# Altium schematic sheet Microcontroller's_Prephirals_Sheet.SchDoc
size A; SheetNumber: 3; SheetTotal: 7
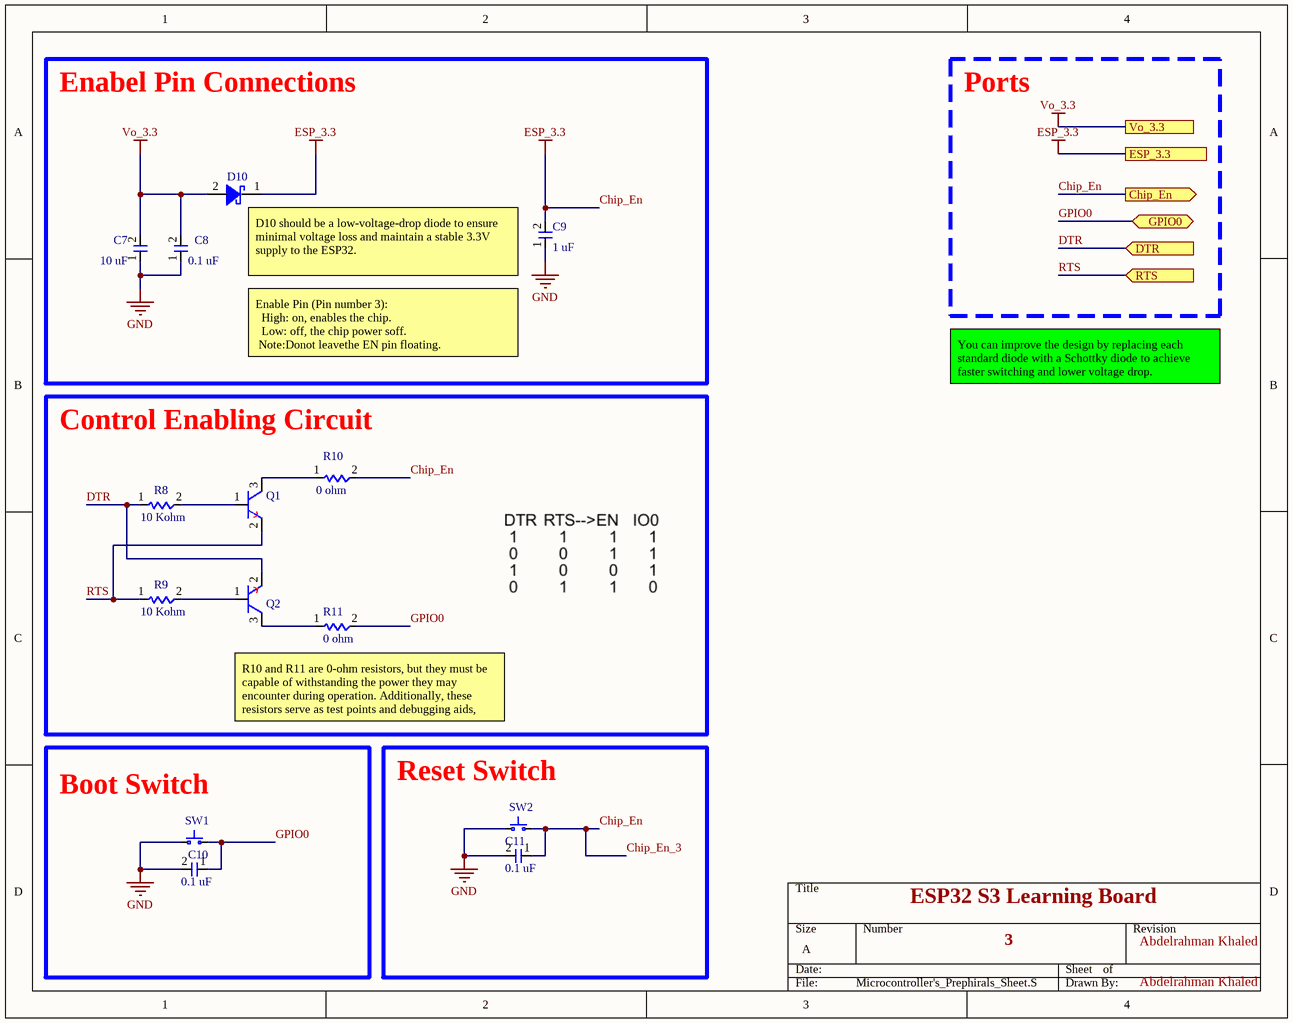
[diagram p0: Microcontroller's_Prephirals_Sheet.SchDoc]

## Parts
C7  10 uF  [Capacitor]
C8  0.1 uF  [Capacitor]
C9  1 uF  [Capacitor]
C10  0.1 uF  [Capacitor]
C11  0.1 uF  [Capacitor]
D10  0.2V Drop Volt  [Schoktty Diode]  (value not drawn)
Q1  NPN Transistor  [NPN Transistor]  (value not drawn)
Q2  NPN Transistor  [NPN Transistor]  (value not drawn)
R8  10 Kohm  [Resistor]
R9  10 Kohm  [Resistor]
R10  0 ohm  [Resistor]
R11  0 ohm  [Resistor]
SW1  Push Button  [Push Button]  (value not drawn)
SW2  Push Button  [Push Button]  (value not drawn)

## Blocks framed on the sheet
Enabel Pin Connections: C7-C9 D10
Control Enabling Circuit: Q1 Q2 R8-R11
Boot Switch: C10 SW1
Reset Switch: C11 SW2

## Ports
Chip_En (out, see Block Diagram[3B], Microcontroller_ESP32_S3[4C]), DTR (in, see Block Diagram[3B], USB_UART_Converter[3B]), ESP_3.3 (see Block Diagram[3B], Microcontroller_ESP32_S3[4C]), GPIO0 (bidir, see Block Diagram[3B], Microcontroller_ESP32_S3[4C]), RTS (in, see Block Diagram[3B], USB_UART_Converter[3B]), Vo_3.3 (see Block Diagram[3B], LDO_Sheet[4B], RGB_Logical_Shifter_Sheet[4A], USB_UART_Converter[4A])

## Nets
Chip_En: C9.2(Pin_2) C11.1(Pin_1) D10.1 R10.2(pin_2) SW2.2 ; port Chip_En, port ESP_3.3  [also labelled Chip_En_3, ESP_3.3]
GND: C7.1(Pin_1) C8.1(Pin_1) C9.1(Pin_1) C10.2(Pin_2) C11.2(Pin_2) SW1.1 SW2.1
Vo_3.3: C7.2(Pin_2) C8.2(Pin_2) D10.2 ; port Vo_3.3
DTR: Q2.2 R8.1(Pin_1) ; port DTR
GPIO0: C10.1(Pin_1) R11.2(pin_2) SW1.2 ; port GPIO0
RTS: Q1.2 R9.1(Pin_1) ; port RTS
NetQ1_1: Q1.1 R8.2(pin_2)
NetQ1_3: Q1.3 R10.1(Pin_1)
NetQ2_1: Q2.1 R9.2(pin_2)
NetQ2_3: Q2.3 R11.1(Pin_1)

## Notes on the sheet
- Ports
- (near D10) D10 should be a low-voltage-drop diode to ensure minimal voltage loss and maintain a stable 3.3V supply to the ESP32.
- Enable Pin (Pin number 3):
  High: on, enables the chip.
  Low: off, the chip power soff.
  Note:Donot leavethe EN pin floating.
- You can improve the design by replacing each standard diode with a Schottky diode to achieve faster switching and lower voltage drop.
- R10 and R11 are 0-ohm resistors, but they must be capable of withstanding the power they may encounter during operation. Additionally, these resistors serve as test points and debugging aids, allowing isolation or monitoring in case of faults in the circuit.
- ESP32 S3 Learning Board
- 3
- Abdelrahman Khaled

## Library data of the parts
C7-C11 = Capacitor
D10 = Schottky Diode: NRVB120ESFT1G; ComponentLink1Description: Link; ComponentLink1URL: https://www.digikey.com/en/products/detail/onsemi/NSR20F40NXT5G/5801655
Q1 Q2 = NPN Transistor: TRANS PREBIAS NPN 50V TO236AB; Links: https://www.digikey.com/en/products/detail/nexperia-usa-inc/PDTD114ETR/5035778
R8-R11 = Resistance
SW1 SW2 = Push Button: Links: https://www.digikey.com/en/products/detail/w%C3%BCrth-elektronik/434133025816/9950810